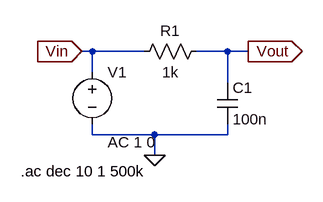
[diagram p0: schematic ex3_2.asc]
ex3_2.asc, the LTspice schematic file:
Version 4
SHEET 1 880 680
WIRE -16 96 -32 96
WIRE 64 96 -16 96
WIRE 192 96 144 96
WIRE 224 96 192 96
WIRE -16 128 -16 96
WIRE 192 144 192 96
WIRE -16 224 -16 208
WIRE 80 224 -16 224
WIRE 192 224 192 208
WIRE 192 224 80 224
WIRE 80 256 80 224
FLAG 80 256 0
FLAG 224 96 Vout
IOPIN 224 96 Out
FLAG -32 96 Vin
IOPIN -32 96 In
SYMBOL res 160 80 R90
WINDOW 0 0 56 VBottom 2
WINDOW 3 32 56 VTop 2
SYMATTR InstName R1
SYMATTR Value 1k
SYMBOL cap 176 144 R0
SYMATTR InstName C1
SYMATTR Value 100n
SYMBOL voltage -16 112 R0
WINDOW 123 24 124 Left 2
WINDOW 39 0 0 Left 0
SYMATTR InstName V1
SYMATTR Value ""
SYMATTR Value2 AC 1 0
TEXT -126 280 Left 2 !.ac dec 10 1 500k

The netlist it stands for:
* ex3_2.asc
R1 Vout Vin 1k
C1 Vout 0 100n
V1 Vin 0 AC 1 0
.ac dec 10 1 500k
.backanno
.end

* Results of the author's LTspice run, read from the files saved beside the schematic
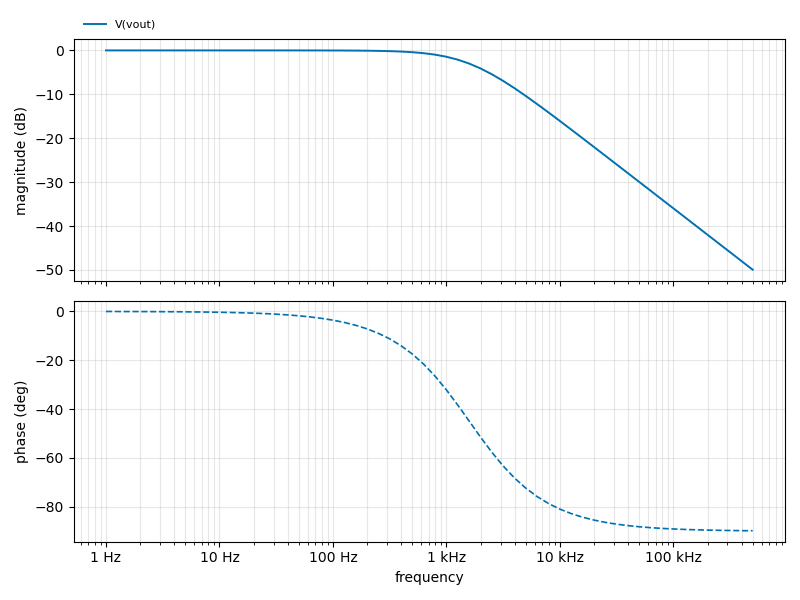
[diagram p1: AC Analysis of ex3_2.asc, plotted from the saved traces]
* AC Analysis, 1 run:
*   V(vout): -0.00 dB at 1 Hz, -49.94 dB at 500 kHz, peak -0.00 dB at 1 Hz, 3 dB below the peak at 1.591 kHz